# EAGLE design main (EAGLE 9.1.3)
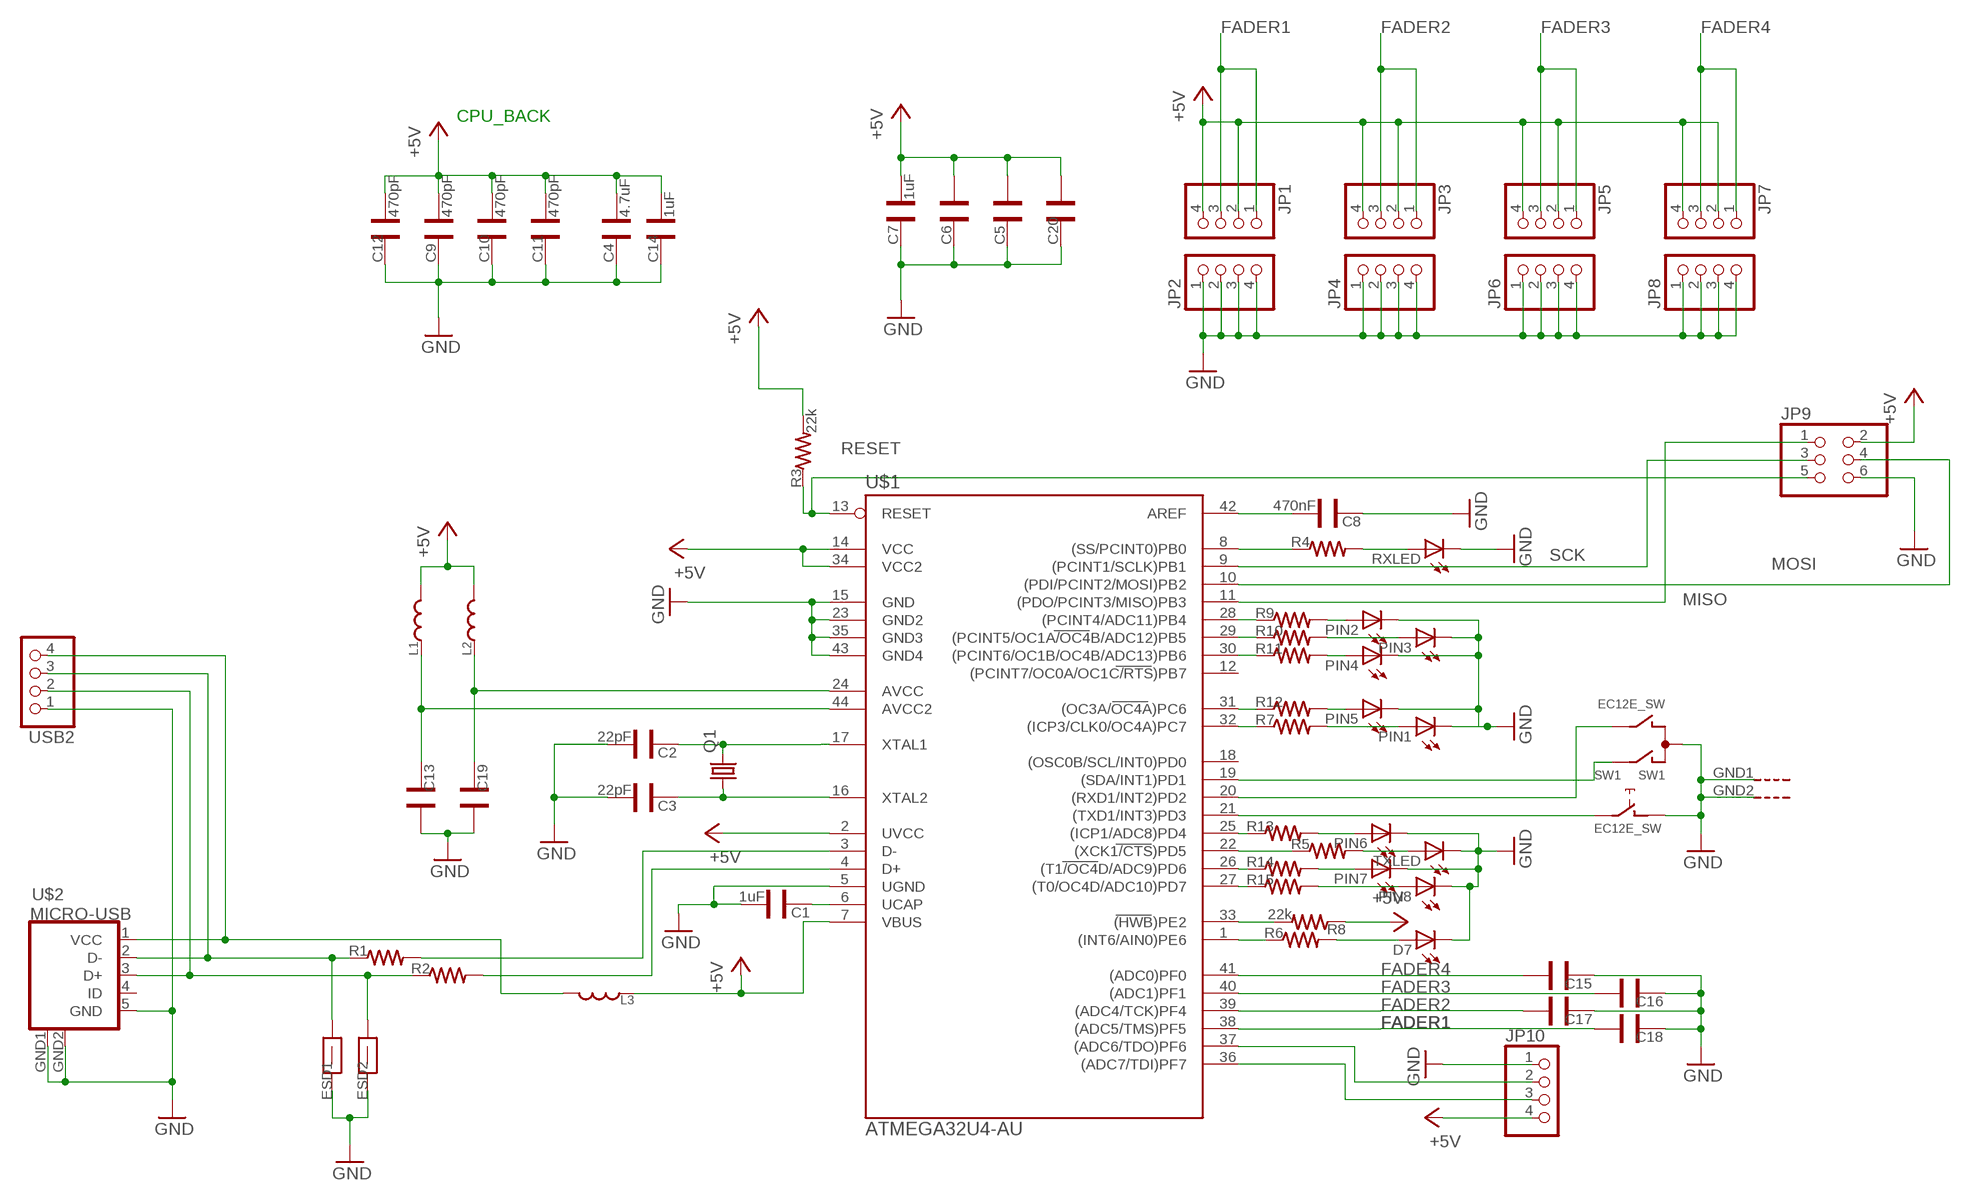
[diagram p0: schematic, sheet 1]

## Parts
C1  1uF  CAP0805  [CAP-0805]
C2  22pF  CAP0603  [CAP-0603]
C3  22pF  CAP0603  [CAP-0603]
C4  4.7uF  CAP0805  [CAP-0805]
C5  CAP0805  [CAP-0805]
C6  CAP0805  [CAP-0805]
C7  1uF  CAP0805  [CAP-0805]
C8  470nF  CAP0603  [CAP-0603]
C9  470pF  CAP0603  [CAP-0603]
C10  470pF  CAP0603  [CAP-0603]
C11  470pF  CAP0603  [CAP-0603]
C12  470pF  CAP0603  [CAP-0603]
C13  CAP0805  [CAP-0805]
C14  1uF  CAP0805  [CAP-0805]
C15  CAP0603  [CAP-0603]
C16  CAP0603  [CAP-0603]
C17  CAP0603  [CAP-0603]
C18  CAP0603  [CAP-0603]
C19  CAP0805  [CAP-0805]
C20  CAP0805  [CAP-0805]
D7  LED0603  [LED-0603]
ESD1  FB  [FB-0603]
ESD2  FB  [FB-0603]
JP1  PINHD-1X4  [1X04]
JP2  PINHD-1X4  [1X04]
JP3  PINHD-1X4  [1X04]
JP4  PINHD-1X4  [1X04]
JP5  PINHD-1X4  [1X04]
JP6  PINHD-1X4  [1X04]
JP7  PINHD-1X4  [1X04]
JP8  PINHD-1X4  [1X04]
JP9  PINHD-2X3  [2X03]
JP10  PINHD-1X4  [1X04]
L1  IND0603  [IND-0603]
L2  IND0603  [IND-0603]
L3  IND0603  [IND-0603]
PIN1  LED0603  [LED-0603]
PIN2  LED0603  [LED-0603]
PIN3  LED0603  [LED-0603]
PIN4  LED0603  [LED-0603]
PIN5  LED0603  [LED-0603]
PIN6  LED0603  [LED-0603]
PIN7  LED0603  [LED-0603]
PIN8  LED0603  [LED-0603]
Q1  CRYSTALHC49S  [HC49/S]
R1  RES0603  [RES-0603]
R2  RES0603  [RES-0603]
R3  22k  RES0603  [RES-0603]
R4  RES0603  [RES-0603]
R5  RES0603  [RES-0603]
R6  RES0603  [RES-0603]
R7  RES0603  [RES-0603]
R8  22k  RES0603  [RES-0603]
R9  RES0603  [RES-0603]
R10  RES0603  [RES-0603]
R11  RES0603  [RES-0603]
R12  RES0603  [RES-0603]
R13  RES0603  [RES-0603]
R14  RES0603  [RES-0603]
R15  RES0603  [RES-0603]
RXLED  LED0603  [LED-0603]
SW1  EC12E_SW  [ALPS_EC12E_SW]
TXLED  LED0603  [LED-0603]
U$1  ATMEGA32U4-AU  [TQFP44]
U$2  MICRO-USB  [MICRO-USB]
USB2  PINHD-1X4  [1X04]

## Nets
+5V: C4.1 C5.1 C6.1 C7.1 C9.1 C10.1 C11.1 C12.1 C14.1 C20.1 JP1.2 JP1.4 JP3.2 JP3.4 JP5.2 JP5.4 JP7.2 JP7.4 JP9.2 JP10.4 L1.1 L2.1 L3.2 R3.2 R8.1 U$1.2(UVCC) U$1.7(VBUS) U$1.14(VCC) U$1.34(VCC2)
FADER1: C18.1 JP1.1 JP1.3 U$1.38((ADC5/TMS)PF5)
FADER2: C17.1 JP3.1 JP3.3 U$1.39((ADC4/TCK)PF4)
FADER3: C16.1 JP5.1 JP5.3 U$1.40((ADC1)PF1)
FADER4: C15.1 JP7.1 JP7.3 U$1.41((ADC0)PF0)
GND: C1.1 C2.1 C3.1 C4.2 C5.2 C6.2 C7.2 C8.2 C9.2 C10.2 C11.2 C12.2 C13.1 C14.2 C15.2 C16.2 C17.2 C18.2 C19.1 C20.2 D7.C ESD1.1 ESD2.1 JP2.1 JP2.2 JP2.3 JP2.4 JP4.1 JP4.2 JP4.3 JP4.4 JP6.1 JP6.2 JP6.3 JP6.4 JP8.1 JP8.2 JP8.3 JP8.4 JP9.6 JP10.1 PIN1.C PIN2.C PIN3.C PIN4.C PIN5.C PIN6.C PIN7.C PIN8.C RXLED.C SW1.C SW1.D SW1.GND1(G) SW1.GND2(G) TXLED.C U$1.5(UGND) U$1.15(GND) U$1.23(GND2) U$1.35(GND3) U$1.43(GND4) U$2.5(GND) U$2.GND1(GND) U$2.GND2(GND) USB2.1
MISO: JP9.1 U$1.11((PDO/PCINT3/MISO)PB3)
MOSI: JP9.4 U$1.10((PDI/PCINT2/MOSI)PB2)
N$1: ESD1.2 R1.1 U$2.2(D-) USB2.3
N$2: ESD2.2 R2.1 U$2.3(D+) USB2.2
N$3: R1.2 U$1.3(D-)
N$4: R2.2 U$1.4(D+)
N$5: R8.2 U$1.33((HWB)PE2)
N$6: C1.2 U$1.6(UCAP)
N$7: C2.2 Q1.2 U$1.17(XTAL1)
N$8: JP10.2 U$1.37((ADC6/TDO)PF6)
N$9: R7.1 U$1.32((ICP3/CLK0/OC4A)PC7)
N$10: R4.1 U$1.8((SS/PCINT0)PB0)
N$11: R4.2 RXLED.A
N$12: R5.1 U$1.22((XCK1/CTS)PD5)
N$13: R5.2 TXLED.A
N$14: C13.2 L1.2 U$1.44(AVCC2)
N$15: C19.2 L2.2 U$1.24(AVCC)
N$16: C8.1 U$1.42(AREF)
N$17: PIN1.A R7.2
N$18: PIN2.A R9.2
N$19: SW1.E U$1.21((TXD1/INT3)PD3)
N$20: SW1.B U$1.20((RXD1/INT2)PD2)
N$21: SW1.A U$1.19((SDA/INT1)PD1)
N$22: PIN5.A R12.2
N$23: PIN4.A R11.2
N$24: PIN3.A R10.2
N$25: JP10.3 U$1.36((ADC7/TDI)PF7)
N$26: R9.1 U$1.28((PCINT4/ADC11)PB4)
N$27: R10.1 U$1.29((PCINT5/OC1A/OC4B/ADC12)PB5)
N$28: R11.1 U$1.30((PCINT6/OC1B/OC4B/ADC13)PB6)
N$29: R12.1 U$1.31((OC3A/OC4A)PC6)
N$30: R13.1 U$1.25((ICP1/ADC8)PD4)
N$31: R14.1 U$1.26((T1/OC4D/ADC9)PD6)
N$32: R15.1 U$1.27((T0/OC4D/ADC10)PD7)
N$33: PIN6.A R13.2
N$34: PIN7.A R14.2
N$35: PIN8.A R15.2
N$36: R6.1 U$1.1((INT6/AIN0)PE6)
N$37: C3.2 Q1.1 U$1.16(XTAL2)
N$38: D7.A R6.2
N$40: L3.1 U$2.1(VCC) USB2.4
RESET: JP9.5 R3.1 U$1.13(RESET)
SCK: JP9.3 U$1.9((PCINT1/SCLK)PB1)
Unconnected: U$1.12((PCINT7/OC0A/OC1C/RTS)PB7) U$1.18((OSC0B/SCL/INT0)PD0) U$2.4(ID)

## Notes on the sheet
- CPU_BACK

## Library data of the parts
C1-C20 = Ai_Passives:CAP
D7 PIN1-PIN8 RXLED TXLED = Ai_LED:LED
ESD1 ESD2 = Ai_Passives:FB: Ferrite bead
JP1-JP8 JP10 USB2 = pinhead:PINHD-1X4: PIN HEADER
JP9 = pinhead:PINHD-2X3: PIN HEADER
L1-L3 = Ai_Passives:IND
Q1 = crystal:CRYSTAL: CRYSTAL; OC_FARNELL: 1667008; OC_NEWARK: unknown
R1-R15 = Ai_Passives:RES
SW1 = switch-alps:EC12E_SW: ALPS rotary Encoder EC12E series with switch; MPN: EC12E2424407; OC_FARNELL: 1520813; OC_NEWARK: 74M1068
U$1 = mega32U4:ATMEGA32U4-AU
U$2 = microusb:MICRO-USB: Micro USB B connector

## Board
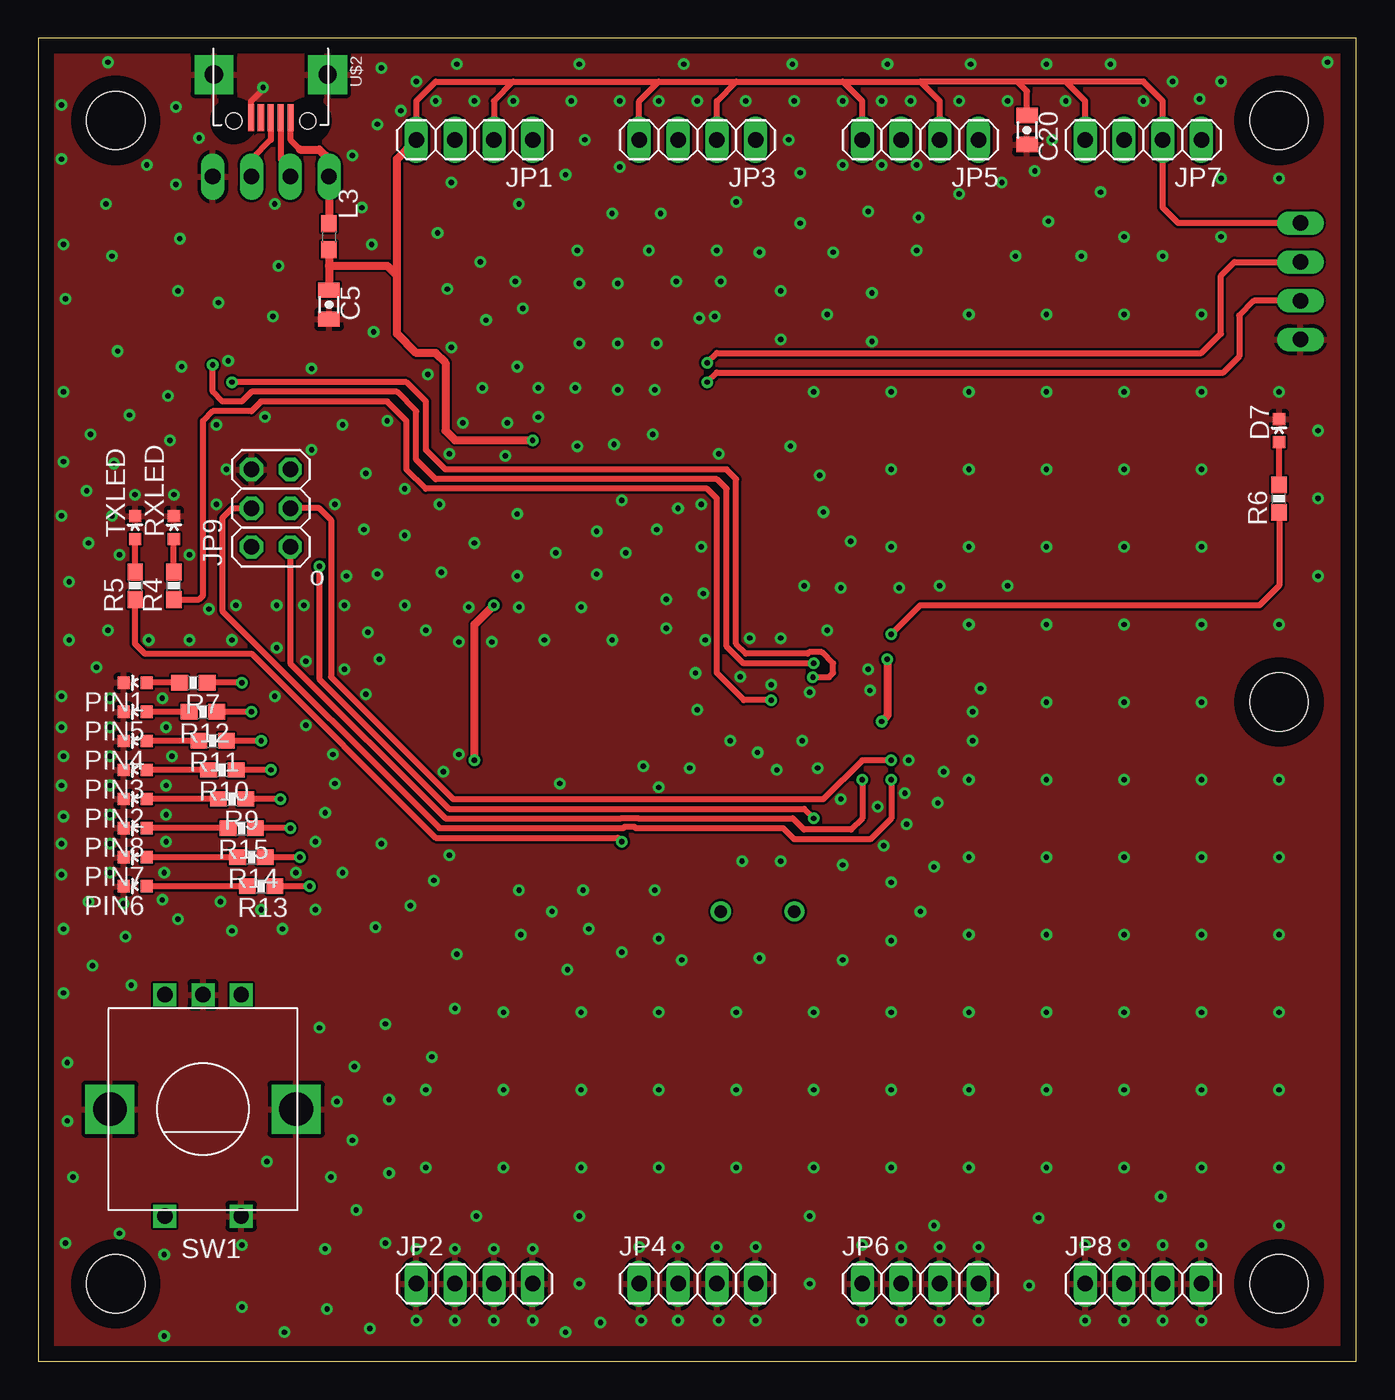
[diagram p1: board, top side]
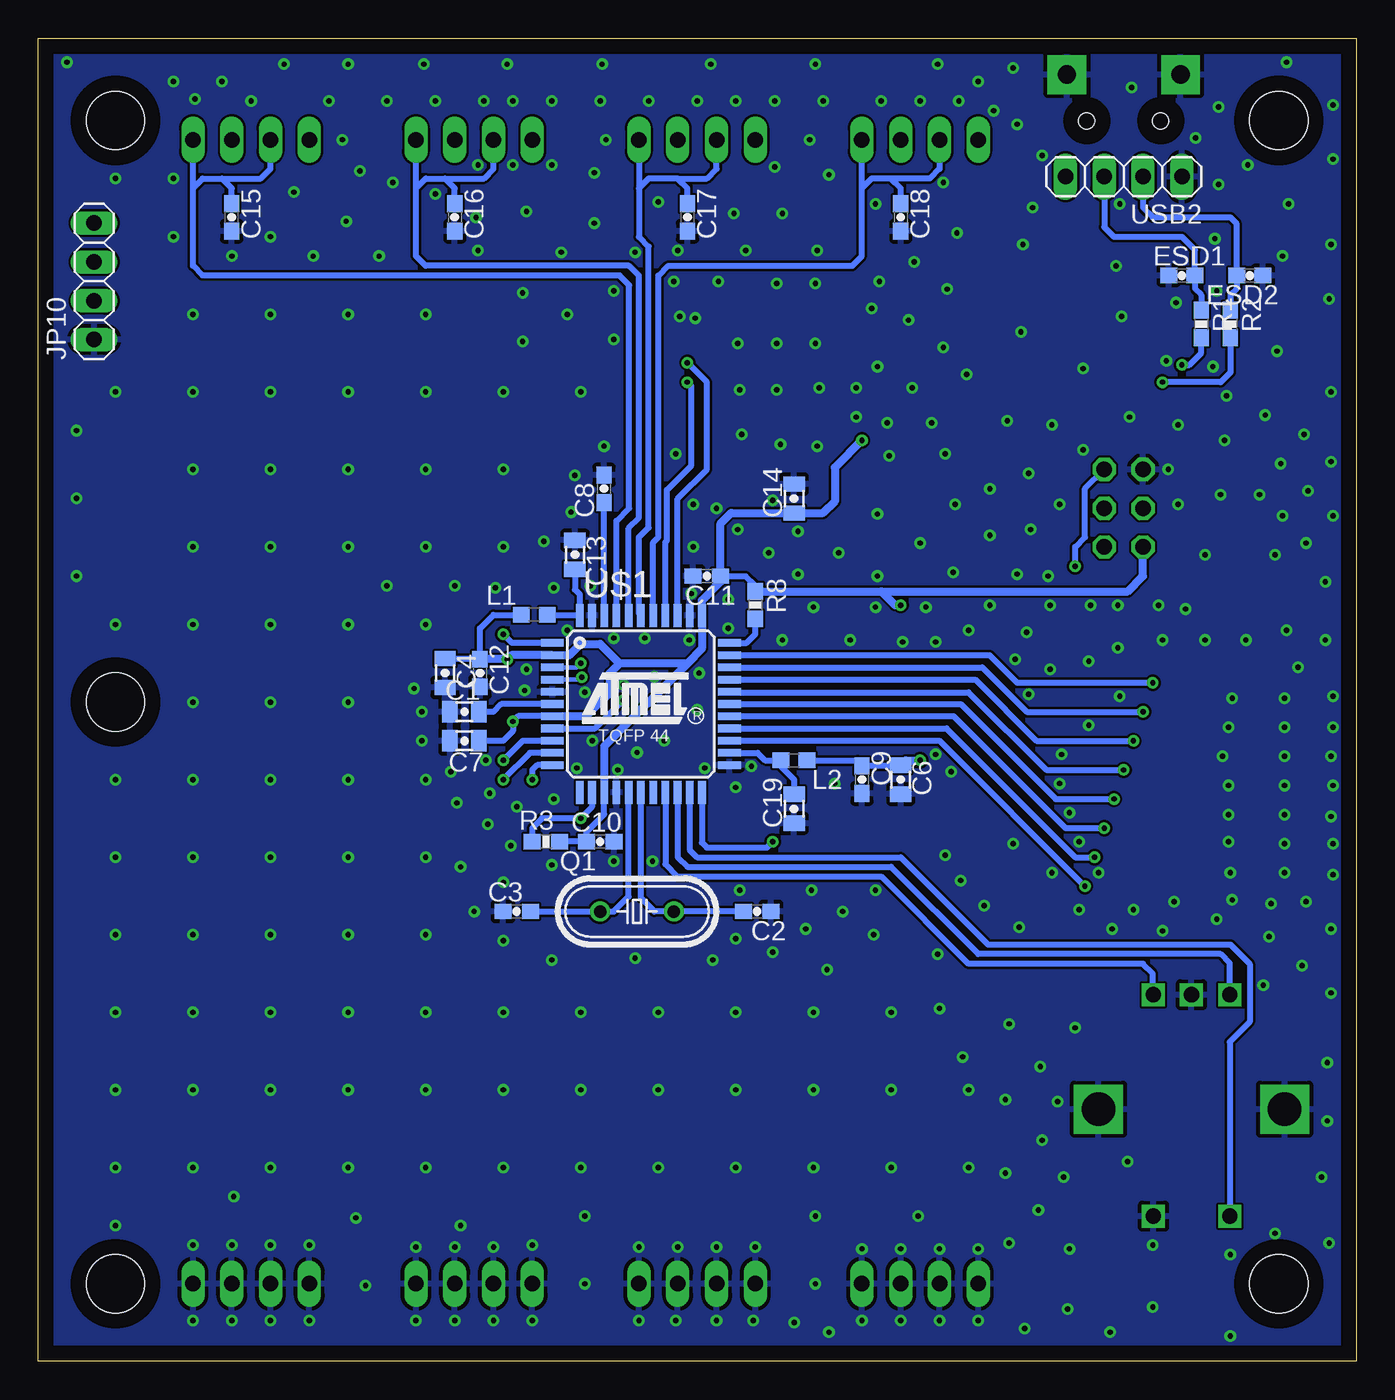
[diagram p2: board, bottom side, seen from below]

Size 86.34 x 86.67 mm. Coordinates in mm from the lower left corner, seen from the top.
Outline: 0,0 86.34,0 86.34,86.67 0,86.67 0,0
Copper layers (1*16): Top 0.035mm / dielectric 1.5mm / Bottom 0.035mm
Design rules "default": minimum track width 6mil, minimum drill 0.35mm, track to track 6mil, track to pad 6mil, pad to pad 6mil, via to via 6mil, smd to smd 6mil, copper to edge 40mil, drill to drill 6mil, minimum pad ring 10mil, minimum via ring 8mil, stop-mask expansion 4mil, vias tented up to drill 0mil, thermal gap 10mil
Holes 3.81 mm at 5.08,81.28 5.08,5.08 81.28,5.08 81.28,81.28 81.28,43.18

### Footprints (pad centres in the part's own frame; a part is rotated, then mirrored left to right if it is on the bottom)
CAP-0805 = smd 1 x 1.4: 1 -0.95,0; 2 0.95,0
CAP-0603 = smd 1.1 x 1: 1 -0.9,0; 2 0.9,0
LED-0603 = smd 0.8 x 0.8: A 0,-0.75; C 0,0.75
FB-0603 = smd 1.1 x 1: 1 -0.85,0; 2 0.85,0
1X04 = drill 1.016 long: 1 -3.81,0; 2 -1.27,0; 3 1.27,0; 4 3.81,0
2X03 = drill 1.016 octagon: 1 -2.54,-1.27; 2 -2.54,1.27; 3 0,-1.27; 4 0,1.27; 5 2.54,-1.27; 6 2.54,1.27
IND-0603 = smd 1.1 x 1: 1 -0.85,0; 2 0.85,0
HC49/S = drill 0.813: 1 -2.413,0; 2 2.413,0
RES-0603 = smd 1.1 x 1: 1 -0.9,0; 2 0.9,0
ALPS_EC12E_SW = drill 1 square: A -2.5,-7.5; B 2.5,-7.5; C 0,-7.5; D -2.5,7; E 2.5,7 | drill 2.2 square: GND1 -6.1,0; GND2 6.1,0
TQFP44 = smd 1.5 x 0.5: 1 -5.8,4; 2 -5.8,3.2; 3 -5.8,2.4; 4 -5.8,1.6; 5 -5.8,0.8; 6 -5.8,0; 7 -5.8,-0.8; 8 -5.8,-1.6; 9 -5.8,-2.4; 10 -5.8,-3.2; 11 -5.8,-4; 23 5.8,-4; 24 5.8,-3.2; 25 5.8,-2.4; 26 5.8,-1.6; 27 5.8,-0.8; 28 5.8,0; 29 5.8,0.8; 30 5.8,1.6; 31 5.8,2.4; 32 5.8,3.2; 33 5.8,4 | smd 0.5 x 1.5: 12 -4,-5.8; 13 -3.2,-5.8; 14 -2.4,-5.8; 15 -1.6,-5.8; 16 -0.8,-5.8; 17 0,-5.8; 18 0.8,-5.8; 19 1.6,-5.8; 20 2.4,-5.8; 21 3.2,-5.8; 22 4,-5.8; 34 4,5.8; 35 3.2,5.8; 36 2.4,5.8; 37 1.6,5.8; 38 0.8,5.8; 39 0,5.8; 40 -0.8,5.8; 41 -1.6,5.8; 42 -2.4,5.8; 43 -3.2,5.8; 44 -4,5.8
MICRO-USB = smd 0.4 x 1.75: 1 -1.3,4.525; 2 -0.65,4.525; 3 0,4.525; 4 0.65,4.525; 5 1.3,4.525 | drill 1.2 pad 2.54 square: GND1 -3.725,1.7; GND2 3.725,1.7 | hole 1.05: -2.425,4.73; 2.425,4.73

### Placement (x,y rotation side)
C1  58.42,42.55 0 bottom
C2  39.24,29.46 180 bottom
C3  54.99,29.46 0 bottom
C4  59.69,45.09 270 bottom
C5  19.05,69.22 270 top
C6  29.84,38.1 270 bottom
C7  58.42,40.64 180 bottom
C8  49.28,57.15 90 bottom
C9  32.38,38.1 270 bottom
C10  49.53,34.04 0 bottom
C11  42.55,51.44 180 bottom
C12  57.4,45.09 270 bottom
C13  51.18,52.83 270 bottom
C14  36.83,56.52 90 bottom
C15  73.66,74.93 270 bottom
C16  59.05,74.93 270 bottom
C17  43.81,74.93 270 bottom
C18  29.84,74.93 270 bottom
C19  36.83,36.2 90 bottom
C20  64.77,80.64 270 top
D7  81.28,60.96 0 top
ESD1  11.43,71.12 0 bottom
ESD2  6.99,71.12 180 bottom
JP1  28.57,80.01 180 top
JP2  28.57,5.08 0 top
JP3  43.18,80.01 180 top
JP4  43.18,5.08 0 top
JP5  57.78,80.01 180 top
JP6  57.78,5.08 0 top
JP7  72.39,80.01 180 top
JP8  72.39,5.08 0 top
JP9  15.24,55.88 90 top
JP10  82.68,70.74 90 bottom
L1  53.85,48.9 0 bottom
L2  36.83,39.37 180 bottom
L3  19.05,73.66 270 top
PIN1  6.35,44.45 90 top
PIN2  6.35,36.83 90 top
PIN3  6.35,38.73 90 top
PIN4  6.35,40.64 90 top
PIN5  6.35,42.55 90 top
PIN6  6.35,31.11 90 top
PIN7  6.35,33.02 90 top
PIN8  6.35,34.92 90 top
Q1  47.12,29.46 0 bottom
R1  10.16,67.94 270 bottom
R2  8.26,67.94 270 bottom
R3  53.09,34.04 0 bottom
R4  8.89,50.8 90 top
R5  6.35,50.8 90 top
R6  81.28,56.52 90 top
R7  10.16,44.45 180 top
R8  39.37,49.53 270 bottom
R9  12.7,36.83 180 top
R10  12.06,38.73 180 top
R11  11.43,40.64 180 top
R12  10.79,42.55 180 top
R13  14.61,31.11 180 top
R14  13.97,33.02 180 top
R15  13.34,34.92 180 top
RXLED  8.89,54.61 0 top
SW1  10.79,16.51 180 top
TXLED  6.35,54.61 0 top
U$1  46.86,43.05 0 bottom
U$2  15.24,85.98 180 top
USB2  15.24,77.6 180 bottom

### Tracks (layer width: path | path; a pad name or v marks a point on that pad's centre or on a via)
+5V  (via drill 0.35)
  Top 0.406: 31.11,83.82 26.04,83.82 24.77,82.55 JP1.4 | 31.11,83.82 40.64,83.82 | 40.64,83.82 45.72,83.82 | 45.72,83.82 52.7,83.82 | 52.7,83.82 57.78,83.82 | 31.11,83.82 29.84,82.55 JP1.2 | JP3.4 39.37,82.55 40.64,83.82 | JP3.2 44.45,82.55 45.72,83.82 | JP5.4 53.98,82.55 52.7,83.82 | JP5.2 59.05,82.55 57.78,83.82 | 67.31,83.82 72.39,83.82 73.66,82.55 JP7.2 73.66,75.56 74.68,74.55 JP10.4 | 67.31,83.82 64.14,83.82 | 64.14,83.82 57.78,83.82 | JP7.4 68.58,82.55 67.31,83.82 | C20.1 64.77,83.19 64.14,83.82
  Top 0.508: v55.62,45.98 55.62,42.28 v55.24,41.91 | v28.57,39.37 28.57,48.26 v29.84,49.53 | JP1.4 23.5,78.74 23.5,71.12 | 23.5,71.12 23.5,67.31 24.77,66.04 26.04,66.04 26.67,65.41 26.67,60.96 27.3,60.33 v32.38,60.33 | L3.2 19.05,71.75 | 19.05,71.75 C5.1 | 19.05,71.75 22.86,71.75 23.5,71.12
  Bottom 0.406: C4.1 59.64,45.98 C12.1 57.4,48.01 56.52,48.9 L1.1 | U$1.7 54.9,42.25 v55.24,41.91 55.24,41.27 55.88,40.64 C7.1 | C11.1 40.01,51.44 39.37,50.8 R8.1 | U$1.14 49.26,35.83 50.43,34.66 C10.1 R3.2 | C6.1 29.89,39 C9.1 | 32.34,39.05 32.66,39.37 L2.1
  Bottom 0.508: 43.81,45.72 48.26,45.72 | 48.26,45.72 48.9,45.09 48.9,43.81 50.46,42.25 U$1.7 | 43.81,45.72 42.86,46.67 U$1.34 42.86,49.85 41.65,51.06 C11.1 41.65,54.88 40.95,55.56 C14.1 34.92,55.56 34.16,56.33 34.16,58.55 v32.38,60.33 | 48.26,45.72 49.53,46.99 50.8,46.99 51.54,46.25 U$1.2 55.35,46.25 v55.62,45.98 C12.1 | R8.1 31.11,50.43 | 31.11,50.43 14.97,50.43 13.97,51.44 JP9.2 | 43.81,45.72 49.26,40.27 U$1.14 | C6.1 29.52,39.37 v28.57,39.37 | v29.84,49.53 30.21,49.53 31.11,50.43 | 32.34,39.05 C9.1
FADER1
  Bottom 0.406: JP1.3 27.3,78.11 27.94,77.47 30.48,77.47 | U$1.38 46.06,53.63 45.72,53.98 45.72,71.12 45.09,71.75 33.02,71.75 32.38,72.39 32.38,76.83 | 32.38,76.83 JP1.1 | 30.48,77.47 31.75,77.47 32.38,76.83 | C18.1 29.84,76.83 30.48,77.47
FADER2
  Bottom 0.406: U$1.39 46.99,48.98 46.99,53.98 46.35,54.61 46.35,73.03 46.99,73.66 46.99,76.83 | 44.45,77.47 42.55,77.47 41.91,78.11 JP3.3 | C17.1 43.81,76.83 44.45,77.47 | JP3.1 46.99,76.83 | 46.99,76.83 46.35,77.47 44.45,77.47
FADER3
  Bottom 0.406: U$1.40 47.66,54.57 46.99,55.24 46.99,71.12 47.62,71.75 60.96,71.75 61.59,72.39 61.59,76.83 | 61.59,76.83 JP5.1 | 61.59,76.83 60.96,77.47 59.69,77.47 | 59.69,77.47 57.15,77.47 56.52,78.11 JP5.3 | C16.1 59.05,76.83 59.69,77.47
FADER4
  Bottom 0.406: U$1.41 48.46,55.04 47.62,55.88 47.62,70.48 48.26,71.12 75.56,71.12 76.2,71.75 76.2,76.83 | 76.2,76.83 JP7.1 | 76.2,76.83 75.56,77.47 74.3,77.47 | 74.3,77.47 71.75,77.47 71.12,78.11 JP7.3 | C15.1 73.66,76.83 74.3,77.47
GND  (via drill 0.35)
  Top 0.406: U$2.5 13.94,82.52 14.73,83.31 v14.73,83.44
  other vias: 26.04,82.55 28.57,82.55 31.11,82.55 34.92,82.55 38.1,82.55 40.64,82.55 43.18,82.55 46.35,82.55 49.53,82.55 52.7,82.55 55.24,82.55 57.15,82.55 60.33,82.55 67.31,82.55 72.39,82.55 71.12,73.66 73.66,72.39 60.33,76.45 57.53,72.77 47.24,72.64 49.15,80.01 66.42,80.01 35.81,80.01 23.75,81.92 17.91,65.02 25.53,64.64 26.92,59.44 30.61,59.31 43.56,50.29 43.43,53.34 43.43,56.13 41.91,55.88 38.23,56.39 40.51,54.48 41.15,49.91 41.15,48.01 43.05,45.09 43.69,47.24 45.97,44.83 48.01,44.32 11.68,61.34 14.86,61.85 22.86,61.59 24,57.15 11.68,56.13 12.32,58.42 12.95,49.53 15.62,49.53 15.62,46.74 17.53,45.85 17.4,49.53 21.46,43.69 15.49,43.56 17.53,41.66 19.3,39.75 19.43,37.85 18.8,35.94 18.16,34.04 16.89,32 26.54,38.61 27.56,39.75 34.16,37.85 39.62,38.99 40.64,37.59 42.67,38.86 48.39,38.73 47.12,39.88 43.18,42.67 45.34,40.64 52.58,36.83 54.99,36.32 56.77,37.21 57.02,39.37 61.21,40.64 59.31,38.61 61.21,42.55 61.72,44.07 54.48,43.94 54.36,45.34 48.64,47.37 46.61,47.37 50.16,50.8 51.44,55.63 53.21,53.72 52.58,50.67 49.28,59.94 51.18,58.04 44.58,59.44 40.26,60.71 37.72,60.07 37.97,66.67 37.97,63.63 40.51,66.67 35.43,66.67 32.77,63.75 32.77,61.85 35.31,59.94 35.18,63.75 40.39,63.63 44.32,68.45 41.78,70.74 43.31,68.33 44.45,72.77 35.31,72.77 34.54,77.72 38.1,78.23 40.01,72.77 37.59,75.18 52.07,72.64 49.91,74.55 40.77,75.18 57.66,74.93 49.91,77.85 52.7,78.36 55.24,78.36 57.53,78.36 4.83,72.39 1.52,78.74 1.52,82.3 4.57,85.09 7.11,78.36 4.45,75.82 1.65,73.15 10.54,80.14 1.78,69.6 5.21,66.17 1.65,63.5 5.97,61.98 8.51,63.25 4.83,55.37 6.35,56.77 8.89,56.77 9.91,52.83 5.33,52.83 1.52,55.37 3.3,53.59 3.17,57.02 1.65,58.93 4.95,58.8 8.64,60.33 3.43,60.71 7.24,47.24 12.7,47.24 11.18,49.28 9.91,47.24 4.7,43.43 4.7,41.53 4.7,39.62 4.7,37.72 4.7,35.81 4.7,33.91 4.7,32 8.26,32 8.38,34.04 8.38,35.81 8.38,37.72 8.76,39.62 8.38,41.53 8.13,43.43 1.52,43.56 1.52,41.53 1.65,39.62 1.52,37.72 1.65,35.69 1.52,33.91 1.52,31.88 5.59,29.97 1.65,28.32 3.3,30.1 11.94,30.1 8.13,30.23 19.94,32 22.1,28.45 22.48,33.91 24.38,29.84 25.91,31.5 26.92,33.15 18.16,29.59 16,28.32 14.61,29.59 12.7,28.19 9.14,28.96 5.33,8.38 2.29,12.06 14.99,13.08 19.18,12.06 13.34,3.56 13.34,7.62 8.26,1.65 1.78,7.75 8.26,6.99 5.71,27.81 3.56,25.91 6.1,24.64 1.65,24.13 1.91,19.56 1.91,15.75 16.13,1.91 18.8,7.37 18.92,3.43 22.73,22.1 18.41,21.84 20.7,19.3 19.56,17.02 22.99,17.14 20.57,14.48 22.99,12.32 20.83,9.91 22.73,7.75 24.77,7.37 27.3,7.37 29.84,7.37 32.38,7.37 24.77,2.67 27.3,2.67 29.84,2.67 32.38,2.67 28.7,9.53 35.43,5.08 46.99,7.49 39.37,7.49 41.91,7.49 44.45,7.49 50.55,5.08 36.83,2.54 39.5,2.67 41.91,2.67 44.58,2.67 46.99,2.67 53.98,2.67 56.52,2.67 58.67,8.89 56.52,7.49 53.98,7.62 73.66,2.67 59.05,7.49 61.59,7.49 73.66,7.62 68.58,7.62 61.59,2.67 71.12,2.67 68.58,2.67 73.53,10.79 64.9,4.95 76.2,2.67 59.05,2.67 34.54,1.91 21.72,2.16 34.67,25.65 38.23,26.8 40.64,27.69 40.39,30.86 42.16,26.29 52.7,26.29 47.24,26.42 48.64,32.77 46.1,32.77 52.7,32.51 55.88,31.37 55.88,27.56 57.78,29.46 55.37,33.78 56.9,35.18 58.67,32.38 58.93,36.58 56.39,50.67 63.12,77.22 66.17,74.68 64.01,72.39 65.28,77.98 68.33,72.39 69.6,76.58 48.64,70.1 44.7,70.74 48.64,66.93 51.69,68.58 54.61,69.98 54.61,66.8 24.77,83.82 22.23,81.03 22.48,84.71 20.07,45.34 22.35,45.97 20.07,49.53 28.19,49.4 27.56,47.12 24,49.53 21.59,47.75 25.4,47.88 29.72,47.12 31.5,49.4 33.15,47.24 35.56,49.4 37.59,47.24 38.48,52.96 20.19,51.44 31.37,55.5 31.37,51.44 33.91,52.96 36.58,54.36 36.58,51.56 28.57,53.59 26.29,56.13 26.42,51.69 24,54.1 22.23,51.56 19.43,56.13 17.91,59.69 21.46,58.17 19.94,61.34 21.34,54.48 27.81,61.47 30.73,61.47 31.37,65.15 27.05,66.42 29.08,63.75 37.97,70.61 35.43,70.61 31.75,68.96 15.37,68.45 21.97,67.44 20.57,78.99 27.05,77.22 15.49,75.82 21.21,75.56 26.16,73.91 15.75,71.75 28.96,72.01 11.81,69.34 26.8,70.23 31.24,70.74 29.34,68.2 51.05,38.86 50.04,40.64 50.55,43.81 51.69,47.88 31.5,30.86 27.43,26.67 31.62,27.94 33.66,29.46 35.69,30.86 36.07,28.32 27.3,23.11 25.78,19.94 71.12,12.7 71.12,17.78 71.12,22.86 71.12,27.94 71.12,33.02 71.12,38.1 71.12,7.62 71.12,43.18 71.12,48.26 71.12,53.34 71.12,58.42 71.12,63.5 71.12,68.58 66.04,68.58 66.04,63.5 66.04,58.42 66.04,53.34 66.04,48.26 66.04,43.18 66.04,38.1 66.04,33.02 66.04,27.94 66.04,22.86 66.04,17.78 66.04,12.7 60.96,68.58 60.96,63.5 60.96,58.42 60.96,53.34 55.88,53.34 55.88,58.42 60.96,38.1 60.96,33.02 60.96,27.94 60.96,22.86 60.96,17.78 60.96,12.7 55.88,12.7 55.88,17.78 55.88,22.86 50.8,12.7 50.8,17.78 50.8,22.86 45.72,22.86 45.72,17.78 45.72,12.7 40.64,12.7 40.64,17.78 40.64,22.86 35.56,12.7 35.56,17.78 35.56,22.86 30.48,12.7 30.48,17.78 30.48,22.86 25.4,12.7 25.4,17.78 9.14,70.1 9.4,65.15 9.27,73.53 9.02,77.09 9.02,82.17 2.03,51.05 4.57,47.88 2.03,47.24 76.2,17.78 76.2,22.86 76.2,27.94 81.28,17.78 81.28,22.86 81.28,27.94 81.28,12.7 76.2,12.7 76.2,7.62 81.28,8.89 76.2,33.02 81.28,33.02 76.2,38.1 81.28,38.1 76.2,43.18 76.2,48.26 81.28,48.26 76.2,53.34 76.2,58.42 76.2,63.5 81.28,63.5 76.2,68.58 81.28,77.47 54.36,75.31 45.72,75.95 31.5,75.82 63.5,82.55 77.47,73.66 77.47,77.47 74.3,83.82 77.47,83.82 84.45,85.09 27.43,84.96 35.43,84.96 42.29,84.96 49.4,84.96 55.63,84.96 61.09,84.96 66.04,84.96 70.23,84.96 76.07,82.68 3.81,45.47 12.45,65.53 21.84,73.15 65.53,9.4 50.55,9.53 35.43,9.53 60.96,48.26 63.5,50.8 59.05,50.8 83.82,56.52 83.82,60.96 83.82,51.44 55.88,63.5 50.8,63.5
  pour Top (isolate 0.051): 88.27,91.44 88.27,-3.81 -8.89,-3.81 -8.89,91.44
  pour Bottom (isolate 0.051): -9.53,92.08 88.9,92.08 88.9,-4.45 -9.53,-4.45
MISO  (via drill 0.35)
  Top 0.406: v53.98,38.1 53.98,35.56 53.24,34.83 50.16,34.83 49.43,35.56 39.29,35.56 39.27,35.58 38.2,35.58 38.18,35.56 26.67,35.56 16.51,45.72 JP9.1
  Bottom 0.406: U$1.11 53.66,39.05 53.98,38.73 v53.98,38.1
MOSI  (via drill 0.35)
  Top 0.406: JP9.4 12.7,55.88 12.06,55.24 12.06,49.15 26.29,34.92 38.33,34.92 38.43,35.02 39.04,35.02 39.14,34.92 48.8,34.92 49.53,34.19 54.51,34.19 55.88,35.56 v55.88,38.1
  Bottom 0.406: U$1.10 54.13,39.85 v55.88,38.1
N$1
  Top 0.406: USB2.3 16.51,78.11 15.89,78.72 U$2.2
  Bottom 0.406: R1.1 10.16,69.85 10.58,70.27 ESD1.2 10.58,72.81 11.43,73.66 15.88,73.66 16.51,74.3 USB2.3
N$2
  Top 0.406: U$2.3 15.24,80.01 13.97,78.74 USB2.2
  Bottom 0.406: R2.1 8.26,69.85 7.83,70.27 ESD2.2 7.83,74.51 8.26,74.93 13.34,74.93 13.97,75.56 USB2.2
N$3  (via drill 0.35)
  Top 0.406: v50.8,45.72 46.2,45.72 45.09,46.84 45.09,57.15 44.45,57.78 26.04,57.78 24.77,59.05 24.77,62.23 23.5,63.5 13.97,63.5 13.34,62.87 12.06,62.87 11.43,63.5 v11.43,65.25
  Bottom 0.305: U$1.3 51.07,45.45 v50.8,45.72
  Bottom 0.406: v11.43,65.25 10.95,65.25 10.16,66.04 R1.2
N$4  (via drill 0.35)
  Top 0.406: v50.74,44.81 51.8,44.81 52.07,45.09 52.07,45.72 51.34,46.45 50.5,46.45 50.4,46.35 46.35,46.35 45.72,46.99 45.72,57.78 45.09,58.42 26.67,58.42 25.4,59.69 25.4,62.87 24.13,64.14 v12.7,64.14
  Bottom 0.305: U$1.4 50.9,44.65 v50.74,44.81
  Bottom 0.406: v12.7,64.14 8.89,64.14 8.26,64.77 R2.2
N$5
  Bottom 0.406: U$1.33 39.94,47.05 39.37,47.62 R8.2
N$6
  Bottom 0.406: U$1.6 56.01,43.05 56.52,42.55 C1.2
N$7
  Bottom 0.406: U$1.17 46.86,30.35 45.97,29.46 Q1.2 C2.2
N$8  (via drill 0.35)
  Top 0.406: v43.81,64.14 44.45,64.77 77.62,64.77 78.66,65.81 78.66,68.5 79.63,69.47 JP10.2
  Bottom 0.406: U$1.37 45.26,53.64 45.16,53.74 45.16,57.07 43.56,58.67 43.56,63.88 v43.81,64.14
N$9  (via drill 0.35)
  Top 0.406: v13.34,44.45 R7.1
  Bottom 0.406: U$1.32 24.03,46.25 22.23,44.45 v13.34,44.45
N$10  (via drill 0.35)
  Top 0.406: v48.01,43.31 46.23,43.31 44.45,45.09 44.45,56.52 43.81,57.15 25.4,57.15 24.13,58.42 24.13,61.59 22.86,62.87 14.61,62.87 13.97,62.23 11.43,62.23 10.79,61.59 10.79,50.16 10.53,49.9 R4.1
  Bottom 0.406: U$1.8 49.86,41.45 v48.01,43.31
N$11
  Top 0.406: R4.2 RXLED.A
N$12  (via drill 0.35)
  Top 0.406: R5.1 6.35,46.99 6.99,46.35 13.97,46.35 26.04,34.29 37.97,34.29 v38.23,34.04
  Bottom 0.406: U$1.22 42.86,33.97 42.55,33.66 38.61,33.66 v38.23,34.04
N$13
  Top 0.406: R5.2 TXLED.A
N$14
  Bottom 0.406: C13.2 51.18,50.55 50.86,50.23 U$1.44 52.96,48.85 L1.2
N$15
  Bottom 0.406: U$1.24 39.22,39.85 38.73,39.37 L2.2 37.68,38.95 36.83,38.1 C19.2
N$16
  Bottom 0.406: U$1.42 49.26,56.24 C8.1
N$17
  Top 0.406: R7.2 PIN1.A
N$18
  Top 0.406: R9.2 PIN2.A
N$19
  Bottom 0.406: U$1.21 43.66,33.5 43.18,33.02 29.84,33.02 24.13,27.3 8.26,27.3 6.99,26.04 6.99,22.23 8.29,20.91 SW1.E
N$20
  Bottom 0.406: U$1.20 44.45,33.02 43.81,32.38 30.48,32.38 24.77,26.67 8.89,26.67 8.29,26.07 SW1.B
N$21
  Bottom 0.406: U$1.19 45.26,32.56 44.45,31.75 31.11,31.75 25.4,26.04 13.97,26.04 13.34,25.4 13.34,24.05 SW1.A
N$22
  Top 0.406: R12.2 PIN5.A
N$23
  Top 0.406: R11.2 PIN4.A
N$24
  Top 0.406: R10.2 PIN3.A
N$25  (via drill 0.35)
  Top 0.406: v43.81,65.41 44.45,66.04 76.2,66.04 77.47,67.31 77.47,71.12 78.36,72.01 JP10.3
  Bottom 0.406: U$1.36 44.46,56.5 42.55,58.42 42.55,64.14 v43.81,65.41
N$26  (via drill 0.35)
  Top 0.406: v15.88,36.83 R9.1
  Bottom 0.406: U$1.28 25.91,43.05 19.68,36.83 v15.88,36.83
N$27  (via drill 0.35)
  Top 0.406: v15.24,38.73 R10.1
  Bottom 0.406: U$1.29 41.02,43.81 25.4,43.81 20.32,38.73 v15.24,38.73
N$28  (via drill 0.35)
  Top 0.406: v14.61,40.64 R11.1
  Bottom 0.406: U$1.30 24.97,44.65 20.95,40.64 v14.61,40.64
N$29  (via drill 0.35)
  Top 0.406: v13.97,42.55 R12.1
  Bottom 0.406: U$1.31 24.5,45.45 21.59,42.55 v13.97,42.55
N$30  (via drill 0.35)
  Top 0.406: v17.78,31.11 R13.1
  Bottom 0.406: U$1.25 27.32,40.65 v17.78,31.11
N$31  (via drill 0.35)
  Top 0.406: v17.14,33.02 R14.1
  Bottom 0.406: U$1.26 26.85,41.45 18.41,33.02 v17.14,33.02
N$32  (via drill 0.35)
  Top 0.406: v16.51,34.92 R15.1
  Bottom 0.406: U$1.27 26.38,42.25 19.05,34.92 v16.51,34.92
N$33
  Top 0.406: R13.2 PIN6.A
N$34
  Top 0.406: R14.2 PIN7.A
N$35
  Top 0.406: R15.2 PIN8.A
N$36  (via drill 0.35)
  Top 0.406: R6.1 81.28,50.8 80.01,49.53 57.78,49.53 v55.88,47.62
  Bottom 0.406: U$1.1 55.31,47.05 v55.88,47.62
N$37
  Bottom 0.406: U$1.16 47.66,30.44 48.64,29.46 Q1.1 C3.2
N$38
  Top 0.406: R6.2 D7.A
N$40
  Top 0.406: 17.14,79.38 16.54,79.98 U$2.1
  Top 0.508: L3.1 USB2.4 19.05,78.74 18.41,79.38 17.14,79.38
RESET  (via drill 0.35)
  Top 0.406: v18.41,52.07 18.41,44.7 26.92,36.2 50.16,36.2 v50.8,35.56
  Bottom 0.406: U$1.13 50.06,36.3 v50.8,35.56 53.34,35.56 53.99,34.91 R3.1 | JP9.5 17.78,57.15 17.78,53.98 18.41,53.34 v18.41,52.07
SCK  (via drill 0.35)
  Top 0.406: JP9.3 18.41,55.88 19.18,55.12 19.18,44.83 27.18,36.83 51.44,36.83 53.98,39.37 v55.88,39.37
  Bottom 0.406: U$1.9 52.68,40.64 54.61,40.64 v55.88,39.37

### Text on the board
tNames: o